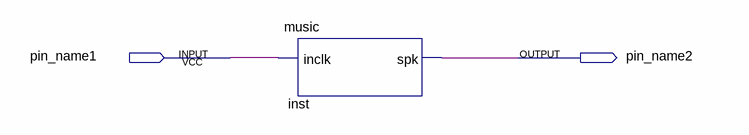
[diagram p0: schematic sheet]
// Quartus schematic music1.bdf as structural Verilog: 1 symbols, 2 pins
module music1 (
  input  pin_name1,
  output pin_name2
);

  music inst (.inclk(pin_name1), .spk(pin_name2));
endmodule
